# EAGLE design NPC (EAGLE 9.6.2)
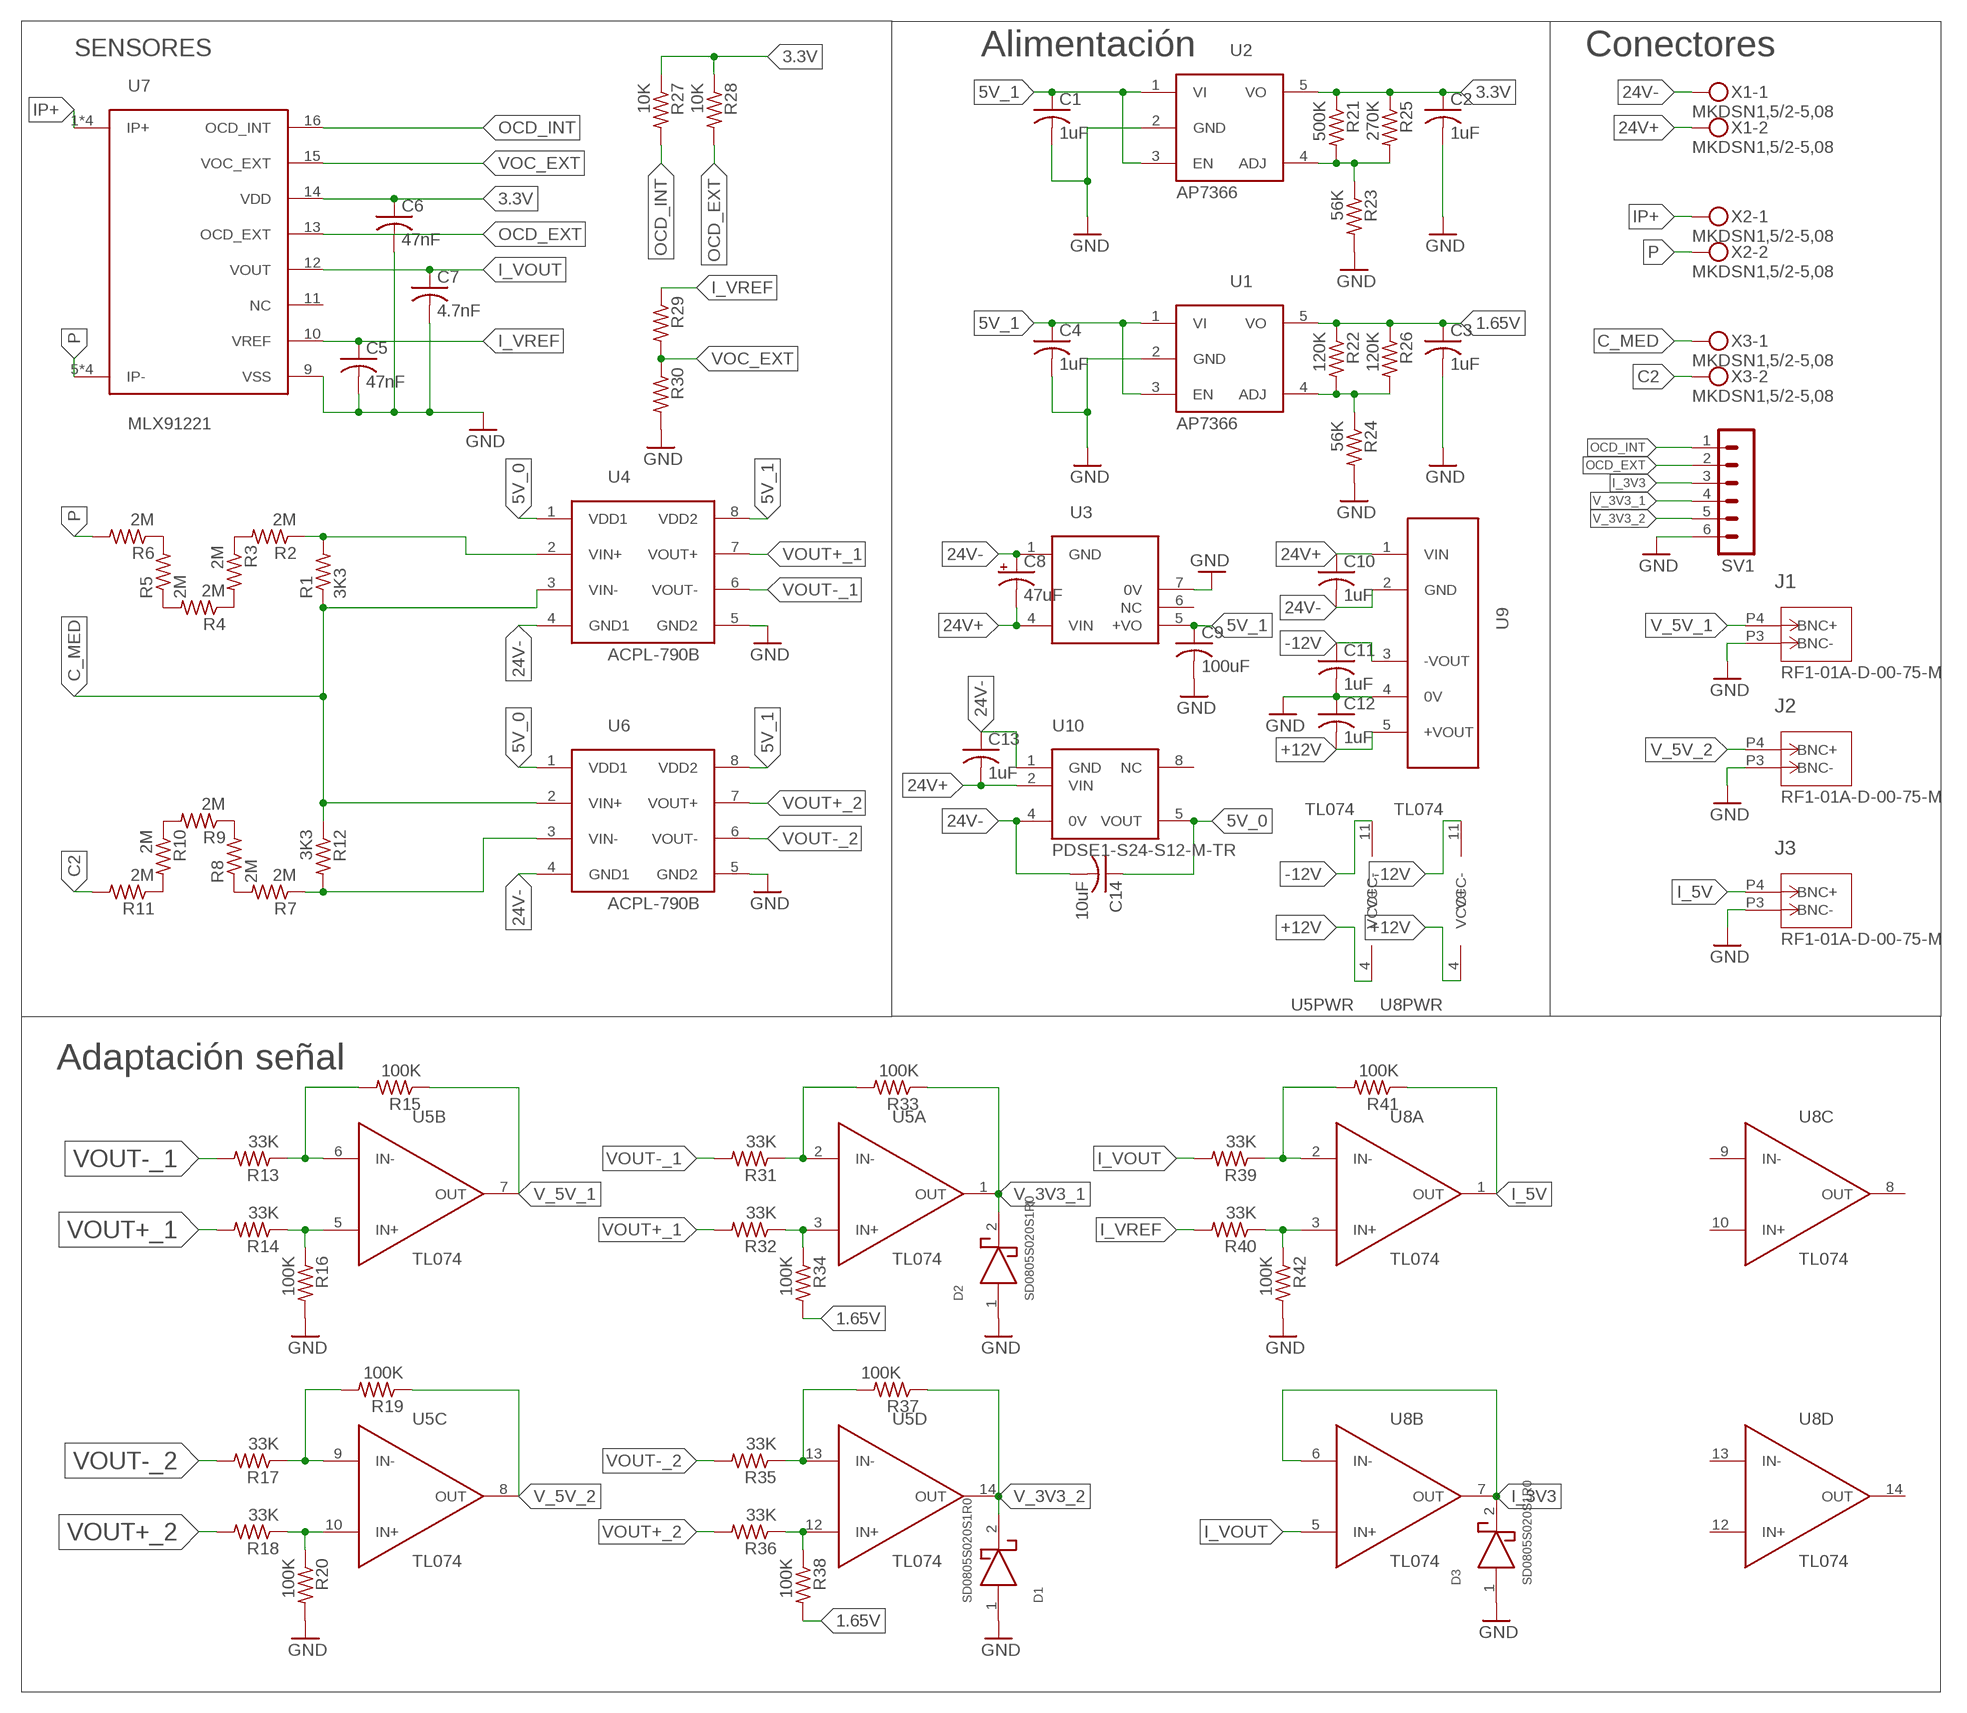
[diagram p0: schematic, sheet 1]

## Parts
C1  1uF  C-USC0805  [C0805]
C2  1uF  C-USC0805  [C0805]
C3  1uF  C-USC0805  [C0805]
C4  1uF  C-USC0805  [C0805]
C5  47nF  C-USC0805  [C0805]
C6  47nF  C-USC0805  [C0805]
C7  4.7nF  C-USC0805  [C0805]
C8  47uF  CPOL-US175TMP-0808  [175TMP-0808]
C9  100uF  C-USC0805  [C0805]
C10  1uF  C-USC0805  [C0805]
C11  1uF  C-USC0805  [C0805]
C12  1uF  C-USC0805  [C0805]
C13  1uF  C-USC0805  [C0805]
C14  10uF  C-USC0805  [C0805]
D1  SD0805S020S1R0  [0805]
D2  SD0805S020S1R0  [0805]
D3  SD0805S020S1R0  [0805]
J1  RF1-01A-D-00-75-M  [BNC]
J2  RF1-01A-D-00-75-M  [BNC]
J3  RF1-01A-D-00-75-M  [BNC]
R1  3K3  R-US_R1206  [R1206]
R2  2M  R-US_R1206  [R1206]
R3  2M  R-US_R1206  [R1206]
R4  2M  R-US_R1206  [R1206]
R5  2M  R-US_R1206  [R1206]
R6  2M  R-US_R1206  [R1206]
R7  2M  R-US_R1206  [R1206]
R8  2M  R-US_R1206  [R1206]
R9  2M  R-US_R1206  [R1206]
R10  2M  R-US_R1206  [R1206]
R11  2M  R-US_R1206  [R1206]
R12  3K3  R-US_R1206  [R1206]
R13  33K  R-US_M0805  [M0805]
R14  33K  R-US_M0805  [M0805]
R15  100K  R-US_M0805  [M0805]
R16  100K  R-US_M0805  [M0805]
R17  33K  R-US_M0805  [M0805]
R18  33K  R-US_M0805  [M0805]
R19  100K  R-US_M0805  [M0805]
R20  100K  R-US_M0805  [M0805]
R21  500K  R-US_M0805  [M0805]
R22  120K  R-US_M0805  [M0805]
R23  56K  R-US_M0805  [M0805]
R24  56K  R-US_M0805  [M0805]
R25  270K  R-US_M0805  [M0805]
R26  120K  R-US_M0805  [M0805]
R27  10K  R-US_M0805  [M0805]
R28  10K  R-US_M0805  [M0805]
R29  R-US_M0805  [M0805]
R30  R-US_M0805  [M0805]
R31  33K  R-US_M0805  [M0805]
R32  33K  R-US_M0805  [M0805]
R33  100K  R-US_M0805  [M0805]
R34  100K  R-US_M0805  [M0805]
R35  33K  R-US_M0805  [M0805]
R36  33K  R-US_M0805  [M0805]
R37  100K  R-US_M0805  [M0805]
R38  100K  R-US_M0805  [M0805]
R39  33K  R-US_M0805  [M0805]
R40  33K  R-US_M0805  [M0805]
R41  100K  R-US_M0805  [M0805]
R42  100K  R-US_M0805  [M0805]
SV1  MA06-1  [MA06-1]
U1  AP7366  [SOT25]
U2  AP7366  [SOT25]
U3  PQP3-D24-S5-M-TR  [DIP-5]
U4  ACPL-790B  [DIP-8]
U5  TL074  [SO-14]
U6  ACPL-790B  [DIP-8]
U7  MLX91221  [SOIC-16W]
U8  TL074  [SO-14]
U9  PEM2-S24-D12-S  [SIP-5]
U10  PDSE1-S24-S12-M-TR  [PDSE1-S24-S12-M-TR]
X1  MKDSN1,5/2-5,08  [MKDSN1,5/2-5,08]
X2  MKDSN1,5/2-5,08  [MKDSN1,5/2-5,08]
X3  MKDSN1,5/2-5,08  [MKDSN1,5/2-5,08]

## Nets
1.65V: C3.1 R22.1 R26.1 R34.2 R38.2 U1.5(VO)
3.3V: C2.1 C6.1 R21.1 R25.1 R27.1 R28.1 U2.5(VO) U7.14(VDD)
5V_0: C14.1 U4.1(VDD1) U6.1(VDD1) U10.5(VOUT)
5V_1: C1.1 C4.1 C9.1 U1.1(VI) U1.3(EN) U2.1(VI) U2.3(EN) U3.5(+VO) U4.8(VDD2) U6.8(VDD2)
24V+: C8.- C10.1 C13.2 U3.4(VIN) U9.1(VIN) U10.2(VIN) X1.2
24V-: C8.+ C10.2 C13.1 C14.2 U3.1(GND) U4.4(GND1) U6.4(GND1) U9.2(GND) U10.1(GND) U10.4(0V) X1.1
+12V: C12.2 U5.4(PWR:VCC+) U8.4(PWR:VCC+) U9.5(+VOUT)
-12V: C11.1 U5.11(PWR:VCC-) U8.11(PWR:VCC-) U9.3(-VOUT)
C2: R11.2 X3.2
C_MED: R1.1 R12.1 U4.3(VIN-) U6.2(VIN+) X3.1
GND: C1.2 C2.2 C3.2 C4.2 C5.2 C6.2 C7.2 C9.2 C11.2 C12.1 D1.1(D+) D2.1(D+) D3.1(D+) J1.P3(BNC-) J2.P3(BNC-) J3.P3(BNC-) R16.2 R20.2 R23.2 R24.2 R30.2 R42.2 SV1.6 U1.2(GND) U2.2(GND) U3.7(0V) U4.5(GND2) U6.5(GND2) U7.9(VSS) U9.4(0V)
I_3V3: D3.2(D-) SV1.3 U8.6(B:IN-) U8.7(B:OUT)
I_5V: J3.P4(BNC+) R41.1 U8.1(A:OUT)
I_VOUT: C7.1 R39.2 U7.12(VOUT) U8.5(B:IN+)
I_VREF: C5.1 R29.1 R40.2 U7.10(VREF)
IP+: U7.1(IP+) U7.2(IP+) U7.3(IP+) U7.4(IP+) X2.1
N$1: R2.2 R3.1
N$2: R3.2 R4.1
N$3: R4.2 R5.1
N$4: R5.2 R6.1
N$5: R7.2 R8.1
N$6: R8.2 R9.1
N$7: R9.2 R10.1
N$8: R10.2 R11.1
N$9: R32.1 R34.1 U5.3(A:IN+)
N$11: R7.1 R12.2 U6.3(VIN-)
N$12: R18.1 R20.1 U5.10(C:IN+)
N$13: R17.1 R19.2 U5.9(C:IN-)
N$14: R21.2 R23.1 R25.2 U2.4(ADJ)
N$15: R22.2 R24.1 R26.2 U1.4(ADJ)
N$16: R14.1 R16.1 U5.5(B:IN+)
N$17: R13.1 R15.2 U5.6(B:IN-)
N$18: R1.2 R2.1 U4.2(VIN+)
N$19: R31.1 R33.2 U5.2(A:IN-)
N$20: R36.1 R38.1 U5.12(D:IN+)
N$21: R35.1 R37.2 U5.13(D:IN-)
N$22: R40.1 R42.1 U8.3(A:IN+)
N$23: R39.1 R41.2 U8.2(A:IN-)
OCD_EXT: R28.2 SV1.2 U7.13(OCD_EXT)
OCD_INT: R27.2 SV1.1 U7.16(OCD_INT)
P: R6.2 U7.5(IP-) U7.6(IP-) U7.7(IP-) U7.8(IP-) X2.2
V_3V3_1: D2.2(D-) R33.1 SV1.4 U5.1(A:OUT)
V_3V3_2: D1.2(D-) R37.1 SV1.5 U5.14(D:OUT)
V_5V_1: J1.P4(BNC+) R15.1 U5.7(B:OUT)
V_5V_2: J2.P4(BNC+) R19.1 U5.8(C:OUT)
VOC_EXT: R29.2 R30.1 U7.15(VOC_EXT)
VOUT+_1: R14.2 R32.2 U4.7(VOUT+)
VOUT+_2: R18.2 R36.2 U6.7(VOUT+)
VOUT-_1: R13.2 R31.2 U4.6(VOUT-)
VOUT-_2: R17.2 R35.2 U6.6(VOUT-)
Unconnected: U3.6(NC) U7.11(NC) U8.8(C:OUT) U8.9(C:IN-) U8.10(C:IN+) U8.12(D:IN+) U8.13(D:IN-) U8.14(D:OUT) U10.8(NC)

## Notes on the sheet
- SENSORES | Alimentación | Conectores
- Adaptación señal

## Library data of the parts
C1-C4 C10-C13 = rcl:C-US: CAPACITOR, American symbol; PARTNO: GRM219R61H105KA73D; SPICEPREFIX: C
C5 C6 = rcl:C-US: CAPACITOR, American symbol; PARTNO: CC0805JRX7R7BB473; SPICEPREFIX: C
C7 = rcl:C-US: CAPACITOR, American symbol; PARTNO: 0805ZC472KAT2A; SPICEPREFIX: C
C8 = rcl:CPOL-US: POLARIZED CAPACITOR, American symbol; PARTNO: HHXC630ARA470MHA0G; SPICEPREFIX: C
C9 = rcl:C-US: CAPACITOR, American symbol; PARTNO: GRM21BR60J107ME15L; SPICEPREFIX: C
C14 = rcl:C-US: CAPACITOR, American symbol; PARTNO: GRM21BC71C106KE11L; SPICEPREFIX: C
D1-D3 = SD0805S020S1R0:SD0805S020S1R0; PARTNO: SD0805S020S1R0
J1-J3 = RF1-01A-D-00-75-M:RF1-01A-D-00-75-M; PARTNO: RF1-01A-D-00-75-M
R1 R12 = rcl:R-US_: RESISTOR, American symbol; PARTNO: ERJ-S08F3301V; SPICEPREFIX: R
R2-R11 = rcl:R-US_: RESISTOR, American symbol; PARTNO: RCV12062M00FKEA; SPICEPREFIX: R
R13 R14 R17 R18 R31 R32 R35 R36 R39 R40 = rcl:R-US_: RESISTOR, American symbol; PARTNO: CR0805-FX-3302ELF; SPICEPREFIX: R
R15 R16 R19 R20 R33 R34 R37 R38 R41 R42 = rcl:R-US_: RESISTOR, American symbol; PARTNO: CR0805-FX-1003ELF; SPICEPREFIX: R
R21 = rcl:R-US_: RESISTOR, American symbol; PARTNO: CR0805-FX-4993ELF; SPICEPREFIX: R
R22 R26 = rcl:R-US_: RESISTOR, American symbol; PARTNO: CRCW0805120KFKEAC; SPICEPREFIX: R
R23 R24 = rcl:R-US_: RESISTOR, American symbol; PARTNO: CR0805-FX-5602ELF; SPICEPREFIX: R
R25 = rcl:R-US_: RESISTOR, American symbol; PARTNO: CRCW0805270KFKEAC; SPICEPREFIX: R
R27 R28 = rcl:R-US_: RESISTOR, American symbol; PARTNO: CR0805-FX-1002ELF; SPICEPREFIX: R
R29 R30 = rcl:R-US_: RESISTOR, American symbol; SPICEPREFIX: R
SV1 = con-lstb:MA06-1: PIN HEADER; OC_FARNELL: unknown; OC_NEWARK: unknown; PARTNO: M20-9750342
U1 U2 = AP7366:AP7366; PARTNO: AP7366-W5-7
U3 = PQP3-D24-S5-M-TR - CUI inc:PQP3-D24-S5-M-TR; PARTNO: PQP3-D24-S5-M-TR
U4 U6 = ACPL-790b:ACPL-790B; PARTNO: ACPL-790B-300E
U5 U8 = TL074:TL074; PARTNO: TL074CDT
U7 = MLX91221:MLX91221; PARTNO: MLX91221KDF-ABF-025-RE
U9 = PEM2-S24-D12-S:PEM2-S24-D12-S; PARTNO: PEM2-S24-D12-S
U10 = PDSE1-S24-S12-M-TR:PDSE1-S24-S12-M-TR; PARTNO: PQP3-D24-S5-M-TR
X1-X3 = 1729128_-_Phoenix_Contact_Profe:MKDSN1,5/2-5,08: MKDSN 1,5/ 2-5,08 Printklemme Nennstrom: 13,5 A Nennspannung: 250 V Rastermaß: 5,08 mm Polzahl: 2 Anschlussart: Schraubanschluss Montage: Löten Anschlussrichtung Leiter/Platine: 0 ° Artikelnummer: 1729128 Source: http://eshop.phoenixcontact.com .. 1729128.pdf; PARTNO: 1797952

## Board
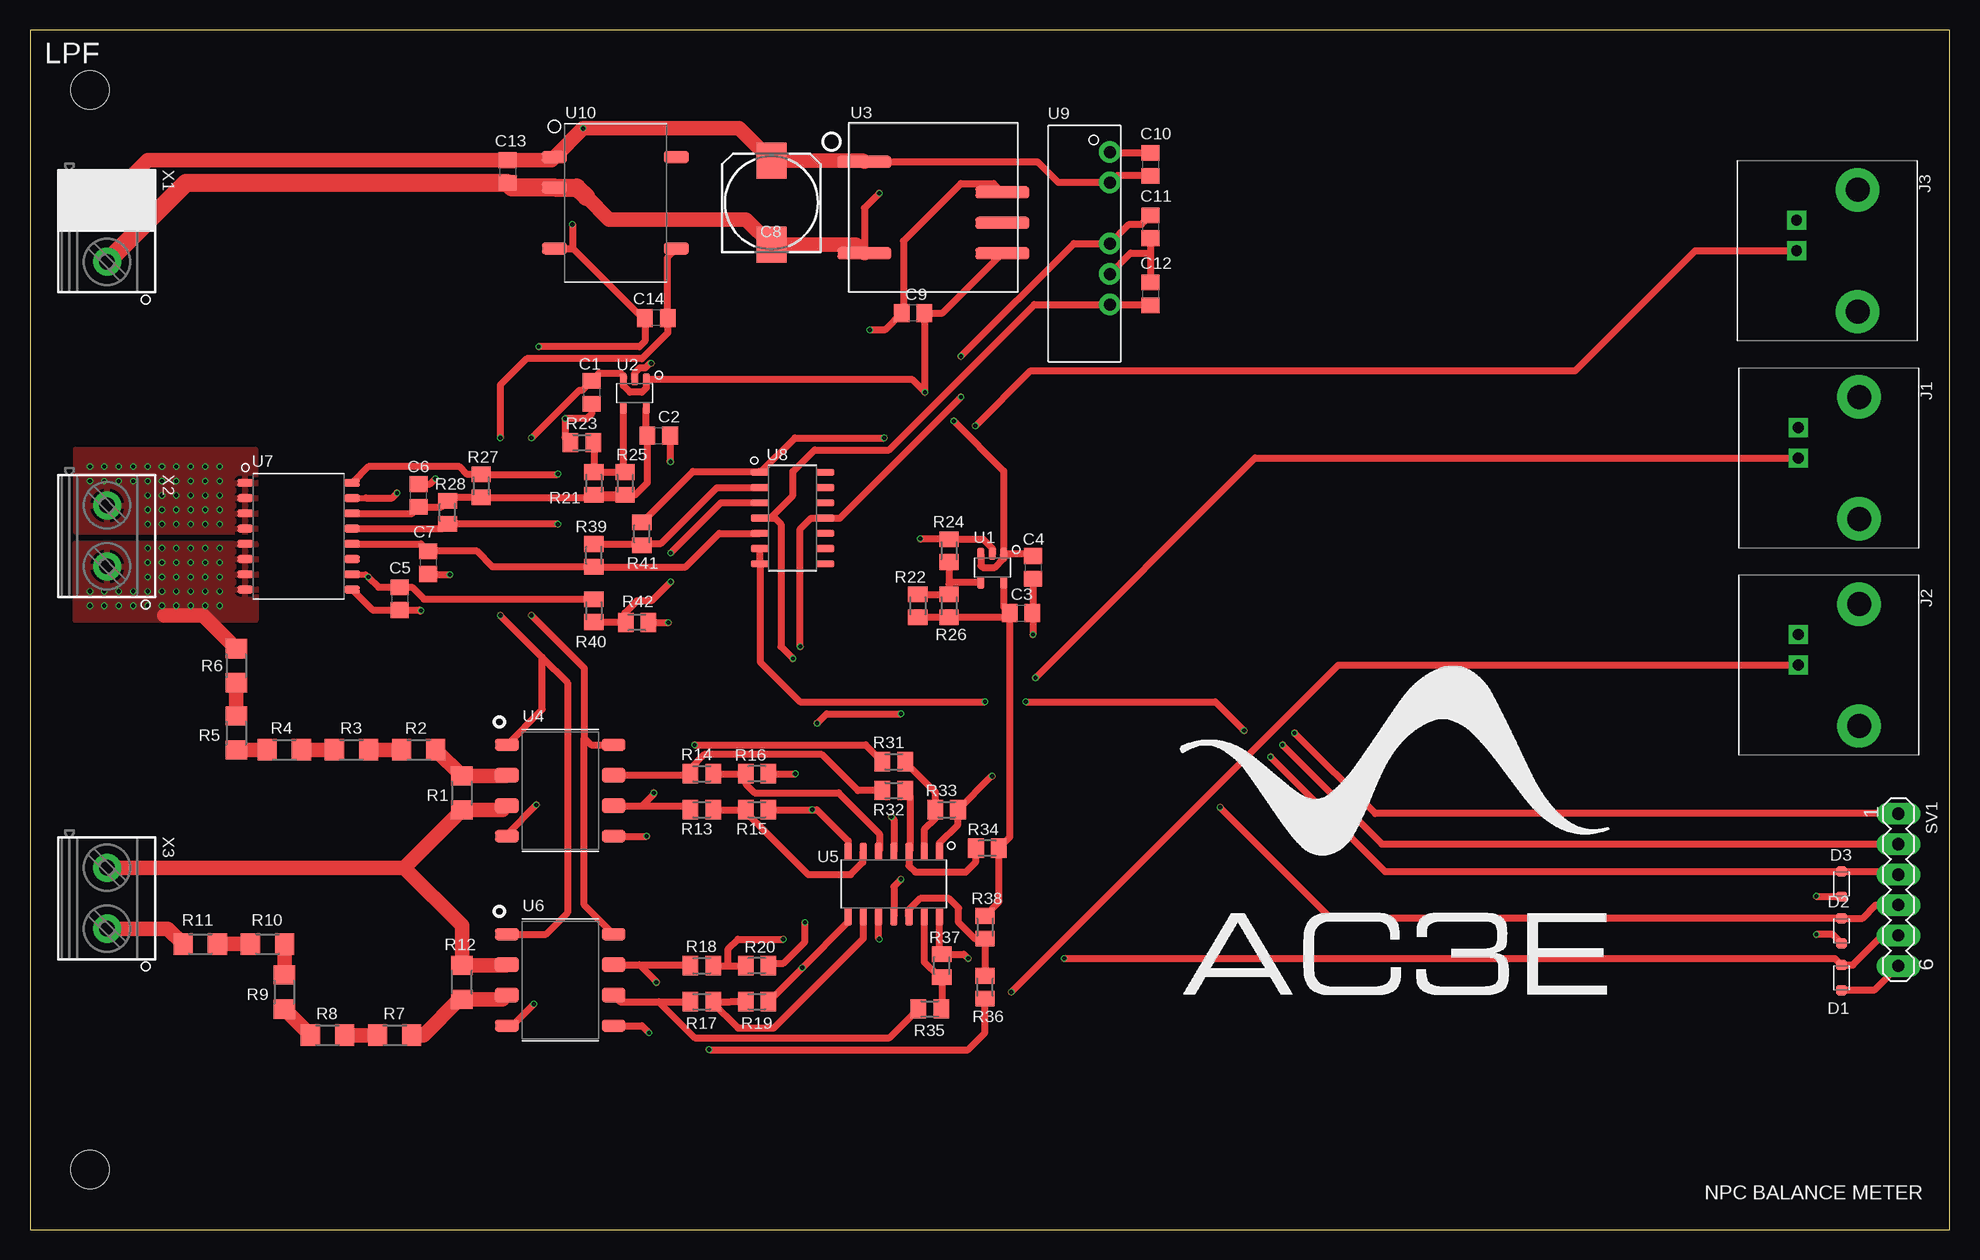
[diagram p1: board, top side]
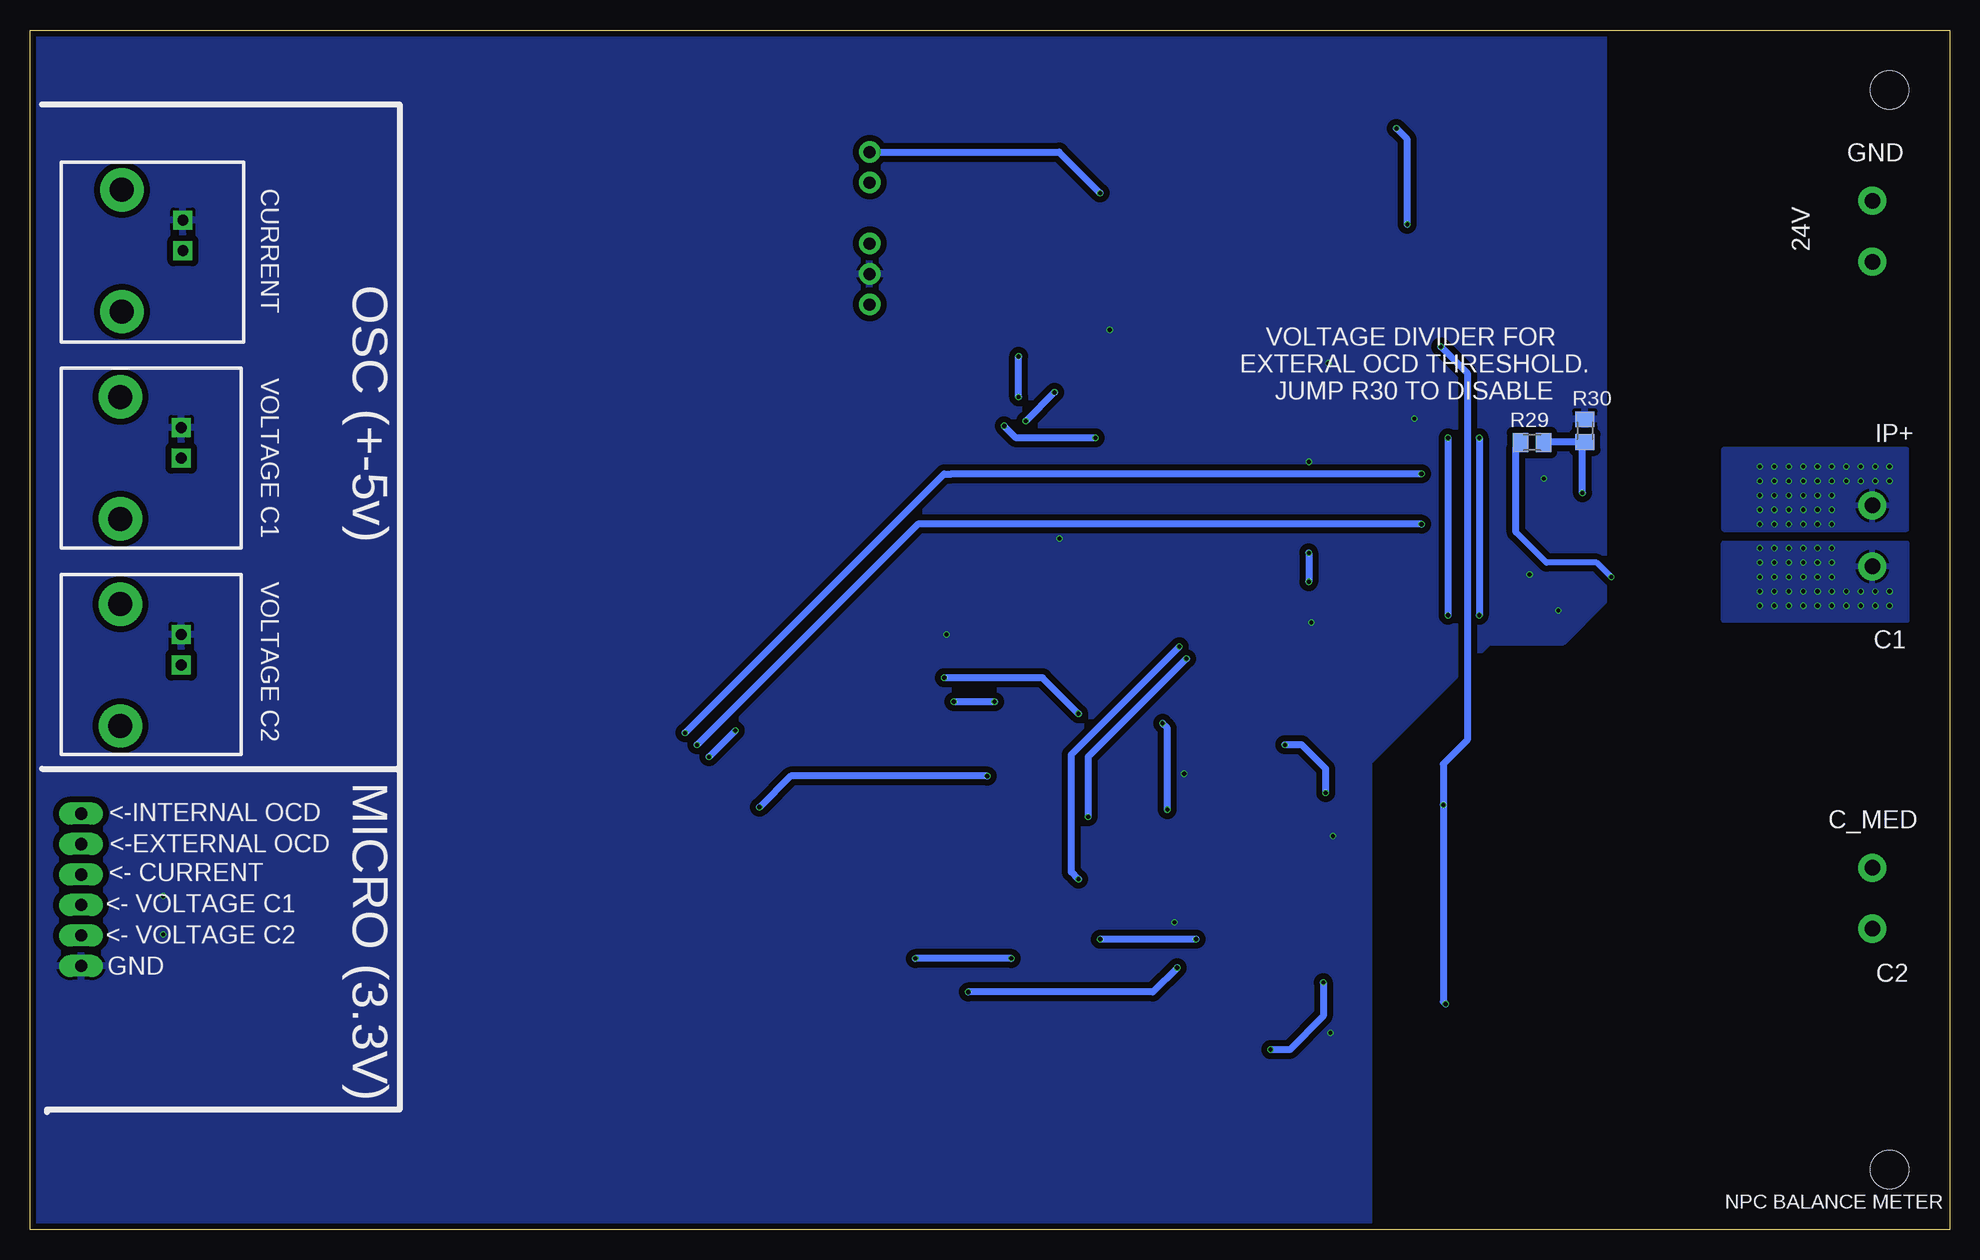
[diagram p2: board, bottom side, seen from below]

Size 160 x 100 mm. Coordinates in mm from the lower left corner, seen from the top.
Outline: 0,0 160,0 160,100 0,100 0,0
Copper layers (1*16): Top 0.035mm / dielectric 1.6mm / Bottom 0.035mm
Design rules "jlcpcb-2layers *": minimum track width 5mil, minimum drill 0.3mm, track to track 5mil, track to pad 5mil, pad to pad 5mil, via to via 5mil, smd to smd 5mil, copper to edge 0.2mm, drill to drill 6mil, minimum pad ring 10mil, minimum via ring 3mil, stop-mask expansion 4mil, vias tented up to drill 15mil, thermal gap 10mil
Holes 3.17 mm at 5,95 5,5

### Footprints (pad centres in the part's own frame; a part is rotated, then mirrored left to right if it is on the bottom)
C0805 = smd 1.3 x 1.5: 1 -0.95,0; 2 0.95,0
175TMP-0808 = smd 3 x 2.5: + 3.5,0; - -3.5,0
0805 = smd 0.8 x 0.9: 1 -1.05,0; 2 1.05,0
BNC = drill 2.01 pad 3: P1 -5.08,2.54; P2 5.08,2.54 | drill 0.89 square: P3 -2.54,-2.54; P4 0,-2.54
R1206 = smd 1.6 x 1.803: 1 -1.422,0; 2 1.422,0
M0805 = smd 1.3 x 1.6: 1 -0.95,0; 2 0.95,0
MA06-1 = drill 1.016 long: 1 -6.35,0; 2 -3.81,0; 3 -1.27,0; 4 1.27,0; 5 3.81,0; 6 6.35,0
SOT25 = smd 1 x 0.6: 1 -1.15,0.95; 2 -1.15,0; 3 -1.15,-0.95; 4 1.25,-0.95; 5 1.25,0.95
DIP-5 = smd 4.496 x 0.991: 1 -5.753,3.81; 4 -5.753,-3.81; 5 5.753,-3.81; 6 5.753,-1.27; 7 5.753,1.27
DIP-8 = smd 2 x 1.016: 1 -4.445,3.81; 4 -4.445,-3.81; 5 4.445,-3.81; 8 4.445,3.81 | smd 2 x 1.27: 2 -4.445,1.27; 3 -4.445,-1.27; 6 4.445,-1.27; 7 4.445,1.27
SO-14 = smd 1.549 x 0.61: 1 -2.7,3.81; 2 -2.7,2.54; 3 -2.7,1.27; 4 -2.7,0; 5 -2.7,-1.27; 6 -2.7,-2.54; 7 -2.7,-3.81; 8 2.71,-3.81; 9 2.71,-2.54; 10 2.71,-1.27; 11 2.71,0; 12 2.71,1.27; 13 2.71,2.54; 14 2.71,3.81
SOIC-16W = smd 1.27 x 0.635: 1 -4.445,4.445; 2 -4.445,3.175; 3 -4.445,1.905; 4 -4.445,0.635; 5 -4.445,-0.635; 6 -4.445,-1.905; 7 -4.445,-3.175; 8 -4.445,-4.445; 9 4.445,-4.445; 10 4.445,-3.175; 11 4.445,-1.905; 12 4.445,-0.635; 13 4.445,0.635; 14 4.445,1.905; 15 4.445,3.175; 16 4.445,4.445
SIP-5 = drill 1 pad 1.5: 1 -7.62,2.108; 2 -5.08,2.108; 3 0,2.108; 4 2.54,2.108; 5 5.08,2.108
PDSE1-S24-S12-M-TR = smd 2.1 x 1: 1 -5.08,3.81; 2 -5.08,1.27; 4 -5.08,-3.81; 5 5.08,-3.81; 8 5.08,3.81
MKDSN1,5/2-5,08 = drill 1.3 pad 2: 1 -2.561,0.025; 2 2.519,0.025

### Placement (x,y rotation side)
C1  46.8,69.8 270 top
C2  52.4,66.2 0 top
C3  82.6,51.4 0 top
C4  83.6,55.2 270 top
C5  30.8,52.6 270 top
C6  32.4,61.2 90 top
C7  33.2,55.6 270 top
C8  61.8,85.6 90 top
C9  73.6,76.4 180 top
C10  93.4,88.8 270 top
C11  93.4,83.6 270 top
C12  93.4,78 270 top
C13  39.8,88.2 270 top
C14  52.2,76 180 top
D1  151,21 90 top
D2  151,24.9 90 top
D3  151,28.8 90 top
J1  149.93,64.32 270 top
J2  149.93,47.06 270 top
J3  149.8,81.6 270 top
R1  36,36.4 90 top
R2  32.4,40 180 top
R3  26.8,40 180 top
R4  21.2,40 180 top
R5  17.2,41.4 90 top
R6  17.2,47 90 top
R7  30.4,16.2 180 top
R8  24.8,16.2 180 top
R9  21.2,19.8 90 top
R10  19.8,23.8 180 top
R11  14.2,23.8 180 top
R12  36,20.6 270 top
R13  56,35 180 top
R14  56,38 180 top
R15  60.6,35 180 top
R16  60.6,38 0 top
R17  56,19 180 top
R18  56,22 180 top
R19  60.6,19 180 top
R20  60.6,22 0 top
R21  47,62.2 90 top
R22  74,52 90 top
R23  46,65.6 180 top
R24  76.6,56.6 90 top
R25  49.6,62.2 90 top
R26  76.6,52 90 top
R27  37.6,62 90 top
R28  34.8,59.8 270 top
R29  34.8,65.6 0 bottom
R30  30.4,66.6 90 bottom
R31  72,39 180 top
R32  72,36.6 180 top
R33  76.4,35 180 top
R34  79.8,31.8 0 top
R35  75,18.4 180 top
R36  79.6,20.2 270 top
R37  76,22 270 top
R38  79.6,25.2 90 top
R39  47,56.2 270 top
R40  47,51.6 90 top
R41  51,58 270 top
R42  50.6,50.6 0 top
SV1  155.74,28.32 270 top
U1  80.21,55.18 270 top
U2  50.41,69.73 270 top
U3  75.3,85.2 0 top
U4  44.2,36.6 0 top
U5  72,28.8 270 top
U6  44.2,20.8 0 top
U7  22.4,57.8 0 top
U8  63.57,59.31 0 top
U9  87.9,82.2 270 top
U10  48.8,85.6 0 top
X1  6.4,83.2 270 top
X2  6.4,57.8 270 top
X3  6.4,27.6 270 top

### Tracks (layer width: path | path; a pad name or v marks a point on that pad's centre or on a via)
1.65V
  Top 0.6: R38.2 80.75,27.3 R34.2 81.65,32.7 C3.1 | R22.1 R26.1 81.3,51.05 C3.1 | U1.5 81.16,51.89 C3.1
3.3V
  Top 0.5: R25.1 49.6,61
  Top 0.6: 49.6,61 37.65,61 R27.1 35.1,61.05 R28.1 34.3,60.25 C6.1 31.86,59.7 U7.14 | U2.5 51.36,66.29 C2.1 51.45,62.25 50.45,61.25 R25.1 R21.1
5V_0  (via drill 0.35)
  Top 0.6: U10.5 53.15,81.06 C14.1 53.15,74.75 51,72.6 41.4,72.6 39.2,70.4 v39.2,66 | U6.1 43.01,24.61 44.8,26.4 44.8,45.6 42.7,47.7 | v39.2,51.2 42.7,47.7 | U4.1 42.7,43.35 42.7,47.7
  Bottom 0.6: v39.2,66 v39.2,51.2
5V_1  (via drill 0.35)
  Top 0.6: U3.5 76.06,76.4 C9.1 74.55,69.85 | 74.55,69.85 v74.6,69.8 | v77,67.4 81.16,63.24 U1.1 | C4.1 83.42,56.33 U1.1 | U1.3 79.26,55.34 79.4,55.2 80.43,55.2 81.16,55.93 U1.1 | 74.55,69.85 73.52,70.88 U2.1 51.36,70.16 51,69.8 50,69.8 49.46,70.34 U2.3 49.46,71.14 49.2,71.4 47.45,71.4 C1.1 46,69.95 45.78,69.95 41.83,66 v41.8,66 | v41.8,51.2 46.2,46.8 46.2,41 | 46.2,41 46.79,40.41 U4.8 | U6.8 46.2,27.05 46.2,41
  Bottom 0.6: v74.6,69.8 v77,67.4 | v41.8,66 v41.8,51.2
24V+  (via drill 0.35)
  Top 0.6: C10.1 90.08,89.75 U9.1 | v70.8,86.4 69.55,85.15 U3.4
  Top 1.2: 46.38,86.1 48.27,84.2 59.7,84.2 C8.- 68.84,82.1 U3.4
  Top 1.5: X1.2 12.99,87.25 C13.2 40.18,86.87 U10.2 45.6,86.87 46.38,86.1
  Bottom 0.6: U9.1 74.22,89.82 v70.8,86.4
24V-  (via drill 0.35)
  Top 0.6: 45.26,81.79 51.05,76 C14.2 51.25,74.05 50.8,73.6 v42.4,73.6 | U10.4 45.26,81.79 | C10.2 90.58,87.85 U9.2 85.72,87.28 83.99,89.01 U3.1 | v42.2,35.4 39.76,32.95 U4.4 | v42,18.8 40.19,16.99 U6.4 | 45.26,81.79 45.26,83.74 v45.2,83.8
  Top 1.2: X1.1 9.81,89.15 C13.1 43.46,89.15 U10.1 v46.11,91.8 59.1,91.8 C8.+ 69.46,89.1 U3.1
  Bottom 0.6: v42.4,73.6 40.2,71.4 40.2,40.8 42.2,38.8 v42.2,35.4 42.2,19 v42,18.8 | v46.11,91.8 45.2,90.89 v45.2,83.8
+12V  (via drill 0.35)
  Top 0.6: C12.2 90.08,77.05 U9.5 83.72,77.12 71.6,65 65.4,65 63.6,63.2 63.6,61.2 61.71,59.31 U8.4 62.09,59.31 62.6,58.8 62.6,48.6 v63.6,47.6 | v71.8,34.4 72,34.2 U5.4
  Bottom 0.6: v63.6,47.6 71.8,39.4 v71.8,34.4
-12V  (via drill 0.35)
  Top 0.6: C11.1 92.65,83.8 91.61,83.8 U9.3 87,82.2 v77.6,72.8 | v77.6,69.4 67.51,59.31 U8.11 65.11,59.31 64.2,58.4 v64.2,48.6 | v72.6,29.2 72,28.6 U5.11
  Bottom 0.6: v77.6,69.4 v77.6,72.8 | v72.6,29.2 73.2,29.8 73.2,39.6 v64.2,48.6
C2
  Top 1.2: X3.2 11.5,25.08 R11.2
C_MED
  Top 1.2: U6.2 39.71,22.02 R12.1 36,25.34 31.18,30.16 | U4.3 39.4,34.98 R1.1 31.18,30.16 | X3.1 31.18,30.16
GND  (via drill 0.35)
  Top 0.6: R16.2 v63.8,38 | R20.2 61.75,22.2 62.8,22.2 64.6,24 v64.6,25.6 | C1.2 46.8,68 46.4,67.6 v44.6,67.6 44.6,66.05 R23.2 | C2.2 53.35,64.05 v53.4,64 | R42.2 v53.2,50.6 | U3.7 80.32,87.2 77.6,87.2 72.8,82.4 72.8,76.55 C9.2 71.25,75 v70,75 | C11.2 93.4,81.4 | 93.4,81.4 C12.1 | U9.4 91.75,81.4 93.4,81.4 | U7.9 28.55,51.65 C5.2 32.45,51.65 32.55,51.55 v32.6,51.6 | C7.2 33.25,54.6 v35,54.6 | C6.2 33.35,62.15 v33.8,62.6 | U2.2 50.41,71.39 50.4,71.4 50.85,71.85 51.31,71.85 51.68,72.21 v51.79,72.21 | v74.2,57.6 74.25,57.55 R24.2 79.45,57.55 80.21,56.79 U1.2 | C4.2 83.6,51.45 C3.2 83.6,51.35 v83.6,49.6 | U4.5 v51.39,32.79 v51.4,32.8 | U6.5 51.01,16.99 v51.6,16.4 | SV1.6 153.72,19.95 D1.1 | D2.1 150.25,24.6 v148.9,24.6 | D3.1 148.95,27.75 v148.9,27.8
  pour Bottom (isolate 0.5): 28.8,99.6 160,99.6 160,63.4 160.2,63.2 160.2,0 48.6,0 48.4,0.2 48.4,39 38.4,49 32.2,49 28.8,52.4
I_3V3  (via drill 0.35)
  Top 0.6: U8.6 U8.7 60.87,47.33 64.2,44 v79.6,44 | v83,44 98.8,44 v101.2,41.6 | v103.4,39.4 112.95,29.85 D3.2 155.48,29.85 SV1.3
  Bottom 0.6: v79.6,44 v83,44 | v101.2,41.6 v103.4,39.4
I_5V  (via drill 0.35)
  Top 0.6: R41.1 55.25,63.2 60.79,63.2 U8.1 63.75,66 v71.2,66 | v78.8,67 83.4,71.6 128.8,71.6 138.8,81.6 J3.P4
  Bottom 0.6: v71.2,66 77.8,66 v78.8,67
I_VOUT
  Top 0.6: U7.12 32.59,57.16 C7.1 37.25,56.55 38.55,55.25 R39.2 54.65,55.25 57.44,58.04 U8.5
I_VREF  (via drill 0.35)
  Top 0.5: U7.10 27.98,54.62 v28.2,54.4
  Top 0.6: v28.2,54.4 29.05,53.55 C5.1 31.85,53.55 32.85,52.55 R40.2
  Bottom 0.5: v28.2,54.4 29.4,55.6 33.6,55.6 36.14,58.14
  Bottom 0.6: 36.14,58.14 36.14,65.21 R29.1
IP+  (via drill 0.35)
  other vias: 15.8,58.8 11,63.6 12.2,63.6 13.4,63.6 14.6,63.6 15.8,63.6 15.8,62.4 14.6,62.4 13.4,62.4 12.2,62.4 11,62.4 13.4,61.2 14.6,61.2 15.8,61.2 12.2,61.2 11,61.2 11,60 12.2,60 13.4,60 14.6,60 15.8,60 14.6,58.8 13.4,58.8 12.2,58.8 11,58.8 6.2,63.6 7.4,63.6 8.6,63.6 9.8,63.6 6.2,62.4 7.4,62.4 8.6,62.4 9.8,62.4 9.8,61.2 9.8,60 9.8,58.8 5,63.6 5,62.4
  pour Top (isolate 0.1): 3.8,58.2 18.8,58.2 18.8,65 3.8,65
  pour Bottom: 18.8,58.4 3.6,58.4 3.6,65 7,65 18.8,65
N$1
  Top 1.2: R2.2 R3.1
N$2
  Top 1.2: R3.2 R4.1
N$3
  Top 1.2: R4.2 17.22,40 R5.1
N$4
  Top 1.2: R5.2 R6.1
N$5
  Top 1.2: R8.1 R7.2
N$6
  Top 1.2: R9.1 R8.2
N$7
  Top 1.2: R10.1 21.22,21.24 R9.2
N$8
  Top 1.2: R11.1 R10.2
N$9
  Top 0.6: R32.1 73.35,36.2 73.35,31.58 U5.3 73.27,30.33 73.8,29.8 78,29.8 78.85,30.65 R34.1
N$11
  Top 1.2: R7.1 32.8,16.2 35.78,19.18 R12.2 39.4,19.18 U6.3
N$12  (via drill 0.35)
  Top 0.6: R18.1 58.2,22 | 58.2,22 R20.1 | 58.2,22 58.2,23.4 59,24.2 v62.8,24.2 | v70.8,24.2 70.73,24.27 U5.10
  Bottom 0.6: v62.8,24.2 v70.8,24.2
N$13
  Top 0.6: R19.2 58.4,19 R17.1 56.8,19 59,16.8 62,16.8 69.46,24.26 U5.9
N$14
  Top 0.5: R21.2 47.2,63.15
  Top 0.6: R23.1 47,65.55 R21.2 | U2.4 49.46,63.29 R25.2 47.2,63.15
N$15
  Top 0.6: R24.1 76.6,53.8 | 76.6,53.8 R26.2 R22.2 | U1.4 76.73,53.93 76.6,53.8
N$16
  Top 0.6: R14.1 R16.1 59.65,37.15 60.4,36.4 67.4,36.4 70.8,33 70.8,31.57 U5.5
N$17
  Top 0.6: R13.1 R15.2 59.65,34.81 64.86,29.6 68.4,29.6 69.4,30.6 69.4,31.44 U5.6
N$18
  Top 1.2: U4.2 39.71,37.82 R1.2 R2.1
N$19
  Top 0.6: R31.1 75.45,36.5 R33.2 75.45,34.25 74.54,33.34 U5.2
N$20
  Top 0.6: R36.1 R38.1 78.75,24.25 77.4,25.6 77.4,26.8 76.6,27.6 74.2,27.6 73.2,26.6 73.2,26.16 U5.12
N$21
  Top 0.6: R35.1 76,18.45 R37.2 75.8,21.05 74.54,22.31 U5.13
N$22  (via drill 0.35)
  Top 0.6: R40.1 49.6,50.65 | 49.6,50.65 R42.1 | U8.3 57.58,60.58 v53.4,56.4 | v53.4,54 51.8,52.4 50.6,52.4 49.6,51.4 49.6,50.65
  Bottom 0.6: v53.4,56.4 v53.4,54
N$23
  Top 0.6: R39.1 50.9,57.15 R41.2 51.15,57.2 52.6,57.2 57.25,61.85 U8.2
OCD_EXT  (via drill 0.35)
  Top 0.6: U7.13 34.38,58.44 R28.2 43.95,58.85 v44,58.8 | SV1.2 112.67,32.13 v104.4,40.4
  Bottom 0.6: v104.4,40.4 86,58.8 v44,58.8
OCD_INT  (via drill 0.35)
  Top 0.6: U7.16 28.2,63.6 35.8,63.6 36.45,62.95 R27.2 43.95,62.95 v44,63 | SV1.1 112.13,34.67 v105.4,41.4
  Bottom 0.6: v44,63 83.2,63 83.8,63 v105.4,41.4
P  (via drill 0.35)
  Top 1.2: R6.2 14.42,51.2 11.2,51.2
  other vias: 11,56.8 12.2,56.8 13.4,56.8 14.6,56.8 15.8,56.8 11,55.6 12.2,55.6 13.4,55.6 14.6,55.6 15.8,55.6 11,54.4 12.2,54.4 13.4,54.4 14.6,54.4 15.8,54.4 11,53.2 12.2,53.2 13.4,53.2 14.6,53.2 15.8,53.2 11,52 12.2,52 13.4,52 14.6,52 15.8,52 9.8,54.4 9.8,55.6 9.8,56.8 5,53.2 6.2,53.2 7.4,53.2 8.6,53.2 9.8,53.2 5,52 6.2,52 7.4,52 8.6,52 9.8,52
  pour Top: 3.8,57.2 18.8,57.2 18.8,50.8 3.8,50.8
  pour Bottom: 18.8,57.2 3.6,57.2 3.6,50.8 18.8,50.8
V_3V3_1  (via drill 0.35)
  Top 0.6: U5.1 75.81,32.21 77.35,33.75 R33.1 80.15,37.8 v80.2,37.8 | v99.2,35.2 108.45,25.95 D2.2 152.75,25.95 153.85,27.05 SV1.4
  Bottom 0.6: v80.2,37.8 96.6,37.8 v99.2,35.2
V_3V3_2  (via drill 0.35)
  Top 0.6: U5.14 75.8,23.15 R37.1 77.85,22.95 v78.2,22.6 | v86.2,22.6 150.45,22.6 D1.2 151.95,22.05 154.41,24.51 SV1.5
  Bottom 0.6: v78.2,22.6 v86.2,22.6
V_5V_1  (via drill 0.35)
  Top 0.6: R15.1 v65.2,35 65.6,35 68.2,32.4 U5.7 | v83.8,46 102.12,64.32 J1.P4 | v65.6,42.2 66.4,43 v72.6,43
  Bottom 0.6: v72.6,43 75.6,46 v83.8,46 | v65.2,35 65.2,41.8 v65.6,42.2
V_5V_2  (via drill 0.35)
  Top 0.6: R19.1 v64.38,21.82 68.19,25.64 U5.8 | v81.8,19.8 109.06,47.06 J2.P4
  Bottom 0.6: v64.38,21.82 66.4,19.8 v81.8,19.8
VOC_EXT  (via drill 0.35)
  Top 0.5: 28,61 26.87,61 U7.15
  Top 0.6: 28,61 30.2,61 v30.6,61.4
  Bottom 0.6: v30.6,61.4 30.6,65.45 R30.1 33.8,65.65 R29.2
VOUT+_1
  Top 0.6: U4.7 54.92,37.87 R14.2 55.05,38.45 56.2,39.6 66,39.6 69,36.6 R32.2
VOUT+_2  (via drill 0.35)
  Top 0.6: U6.7 50.8,22.07 | 50.8,22.07 54.98,22.07 R18.2 | 50.8,22.07 52.2,20.67 v52.2,20.6 | R36.2 79.6,16.4 78.2,15 v56.6,15
  Bottom 0.6: v52.2,20.6 52.2,17.8 55,15 v56.6,15
VOUT-_1  (via drill 0.35)
  Top 0.6: U4.6 51,35.33 | 51,35.33 54.72,35.33 R13.2 | 51,35.33 52,36.33 v52,36.4 | v55.4,40.4 69.65,40.4 R31.2
  Bottom 0.6: v52,36.4 52,38.4 54,40.4 v55.4,40.4
VOUT-_2
  Top 0.6: 52.4,19 49.17,19 U6.6 | 52.4,19 R17.2 | 52.4,19 55.4,16 71.65,16 R35.2

### Text on the board
tPlace: LPF | NPC BALANCE METER
bPlace: GND | 24V | CURRENT | VOLTAGE DIVIDER FOR / EXTERAL OCD THRESHOLD. / JUMP R30 TO DISABLE | OSC (+-5v) | IP+ | VOLTAGE C1 | C1 | VOLTAGE C2 | <-INTERNAL OCD | C_MED | <-EXTERNAL OCD | <- CURRENT | <- VOLTAGE C1 | <- VOLTAGE C2 | MICRO (3.3V) | GND | C2 | NPC BALANCE METER